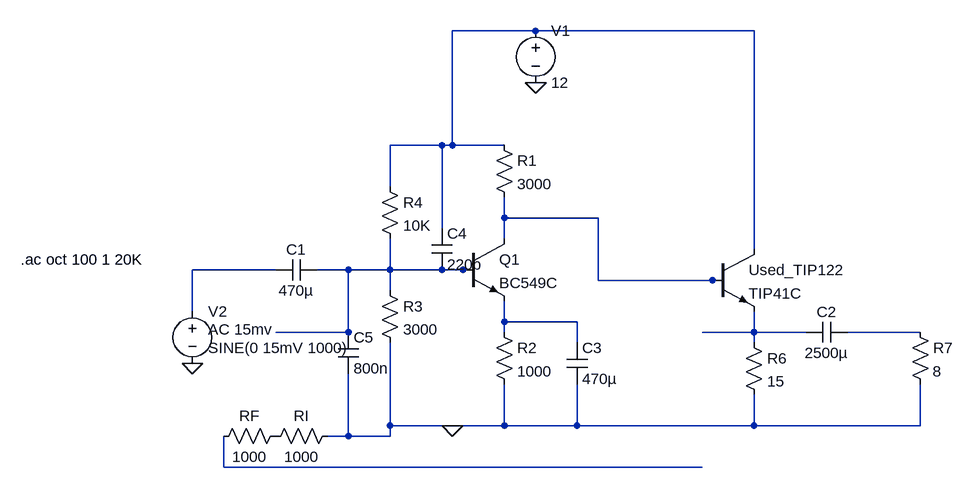
[diagram p0: schematic Awesome - CE BC549 and Tip122 with FB.asc]
Awesome - CE BC549 and Tip122 with FB.asc, the LTspice schematic file:
Version 4
SHEET 1 920 680
WIRE 272 -256 144 -256
WIRE 608 -256 272 -256
WIRE 128 -80 48 -80
WIRE 144 -80 144 -256
WIRE 144 -80 128 -80
WIRE 224 -80 144 -80
WIRE 48 -16 48 -80
WIRE 224 32 224 0
WIRE 368 32 224 32
WIRE 128 48 128 -80
WIRE 224 64 224 32
WIRE 608 80 608 -256
WIRE -128 112 -256 112
WIRE -16 112 -64 112
WIRE 48 112 48 64
WIRE 48 112 -16 112
WIRE 128 112 48 112
WIRE 160 112 128 112
WIRE 176 112 160 112
WIRE 368 128 368 32
WIRE 544 128 368 128
WIRE 560 128 544 128
WIRE 48 144 48 112
WIRE -256 176 -256 112
WIRE 224 192 224 160
WIRE 336 192 224 192
WIRE -16 208 -16 112
WIRE -16 208 -128 208
WIRE 224 208 224 192
WIRE 608 208 608 176
WIRE 608 208 528 208
WIRE 688 208 608 208
WIRE 864 208 752 208
WIRE 336 224 336 192
WIRE 608 224 608 208
WIRE 48 352 48 224
WIRE 144 352 48 352
WIRE 224 352 224 288
WIRE 224 352 144 352
WIRE 336 352 336 288
WIRE 336 352 224 352
WIRE 608 352 608 304
WIRE 608 352 336 352
WIRE 864 352 864 288
WIRE 864 352 608 352
WIRE -16 368 -16 272
WIRE -16 368 -48 368
WIRE 48 368 48 352
WIRE 48 368 -16 368
WIRE -208 416 -208 368
WIRE 528 416 -208 416
FLAG 272 -176 0
FLAG 144 352 0
FLAG -256 256 0
SYMBOL npn 160 64 R0
SYMATTR InstName Q1
SYMATTR Value BC549C
SYMBOL res 208 -96 R0
SYMATTR InstName R1
SYMATTR Value 3000
SYMBOL voltage 272 -272 R0
WINDOW 123 0 0 Left 2
WINDOW 39 0 0 Left 2
SYMATTR InstName V1
SYMATTR Value 12
SYMBOL res 32 -32 R0
SYMATTR InstName R4
SYMATTR Value 10K
SYMBOL res 32 128 R0
SYMATTR InstName R3
SYMATTR Value 3000
SYMBOL res 208 192 R0
SYMATTR InstName R2
SYMATTR Value 1000
SYMBOL cap 320 224 R0
SYMATTR InstName C3
SYMATTR Value 470µ
SYMBOL cap -64 96 R90
WINDOW 0 0 32 VBottom 2
WINDOW 3 32 32 VTop 2
SYMATTR InstName C1
SYMATTR Value 470µ
SYMBOL voltage -256 160 R0
WINDOW 123 24 44 Left 2
WINDOW 39 0 0 Left 2
WINDOW 3 24 72 Left 2
SYMATTR Value2 AC 15mv
SYMATTR InstName V2
SYMATTR Value SINE(0 15mV 1000)
SYMBOL npn 544 80 R0
SYMATTR InstName Used_TIP122
SYMATTR Value TIP41C
SYMBOL res 592 208 R0
SYMATTR InstName R6
SYMATTR Value 15
SYMBOL res 848 192 R0
WINDOW 3 35 76 Left 2
SYMATTR Value 8
SYMATTR InstName R7
SYMBOL cap 752 192 R90
WINDOW 0 0 32 VBottom 2
WINDOW 3 32 32 VTop 2
SYMATTR InstName C2
SYMATTR Value 2500µ
SYMBOL res -112 352 R90
WINDOW 0 0 56 VBottom 2
WINDOW 3 32 56 VTop 2
SYMATTR InstName RF
SYMATTR Value 1000
SYMBOL res -32 352 R90
WINDOW 0 0 56 VBottom 2
WINDOW 3 32 56 VTop 2
SYMATTR InstName RI
SYMATTR Value 1000
SYMBOL cap 112 48 R0
SYMATTR InstName C4
SYMATTR Value 220p
SYMBOL cap -32 208 R0
SYMATTR InstName C5
SYMATTR Value 800n
TEXT -520 96 Left 2 !.ac oct 100 1 20K

The netlist it stands for:
* Awesome - CE BC549 and Tip122 with FB.asc
Q1 N002 N004 N005 0 BC549C
R1 N001 N002 3000
V1 N001 0 12
R4 N001 N004 10K
R3 N004 0 3000
R2 N005 0 1000
C3 N005 0 470µ
C1 N004 N003 470µ
V2 N003 0 SINE(0 15mV 1000) AC 15mv
Q§Used_TIP122 N001 N002 N006 0 TIP41C
R6 N006 0 15
R7 N007 0 8
C2 N007 N006 2500µ
RF P001 N008 1000
RI 0 P001 1000
C4 N001 N004 220p
C5 N004 0 800n
.model NPN NPN
.model PNP PNP
.lib standard.bjt
.ac oct 100 1 20K
.backanno
.end